# EAGLE design USB_Adapter (EAGLE 6.5.0)
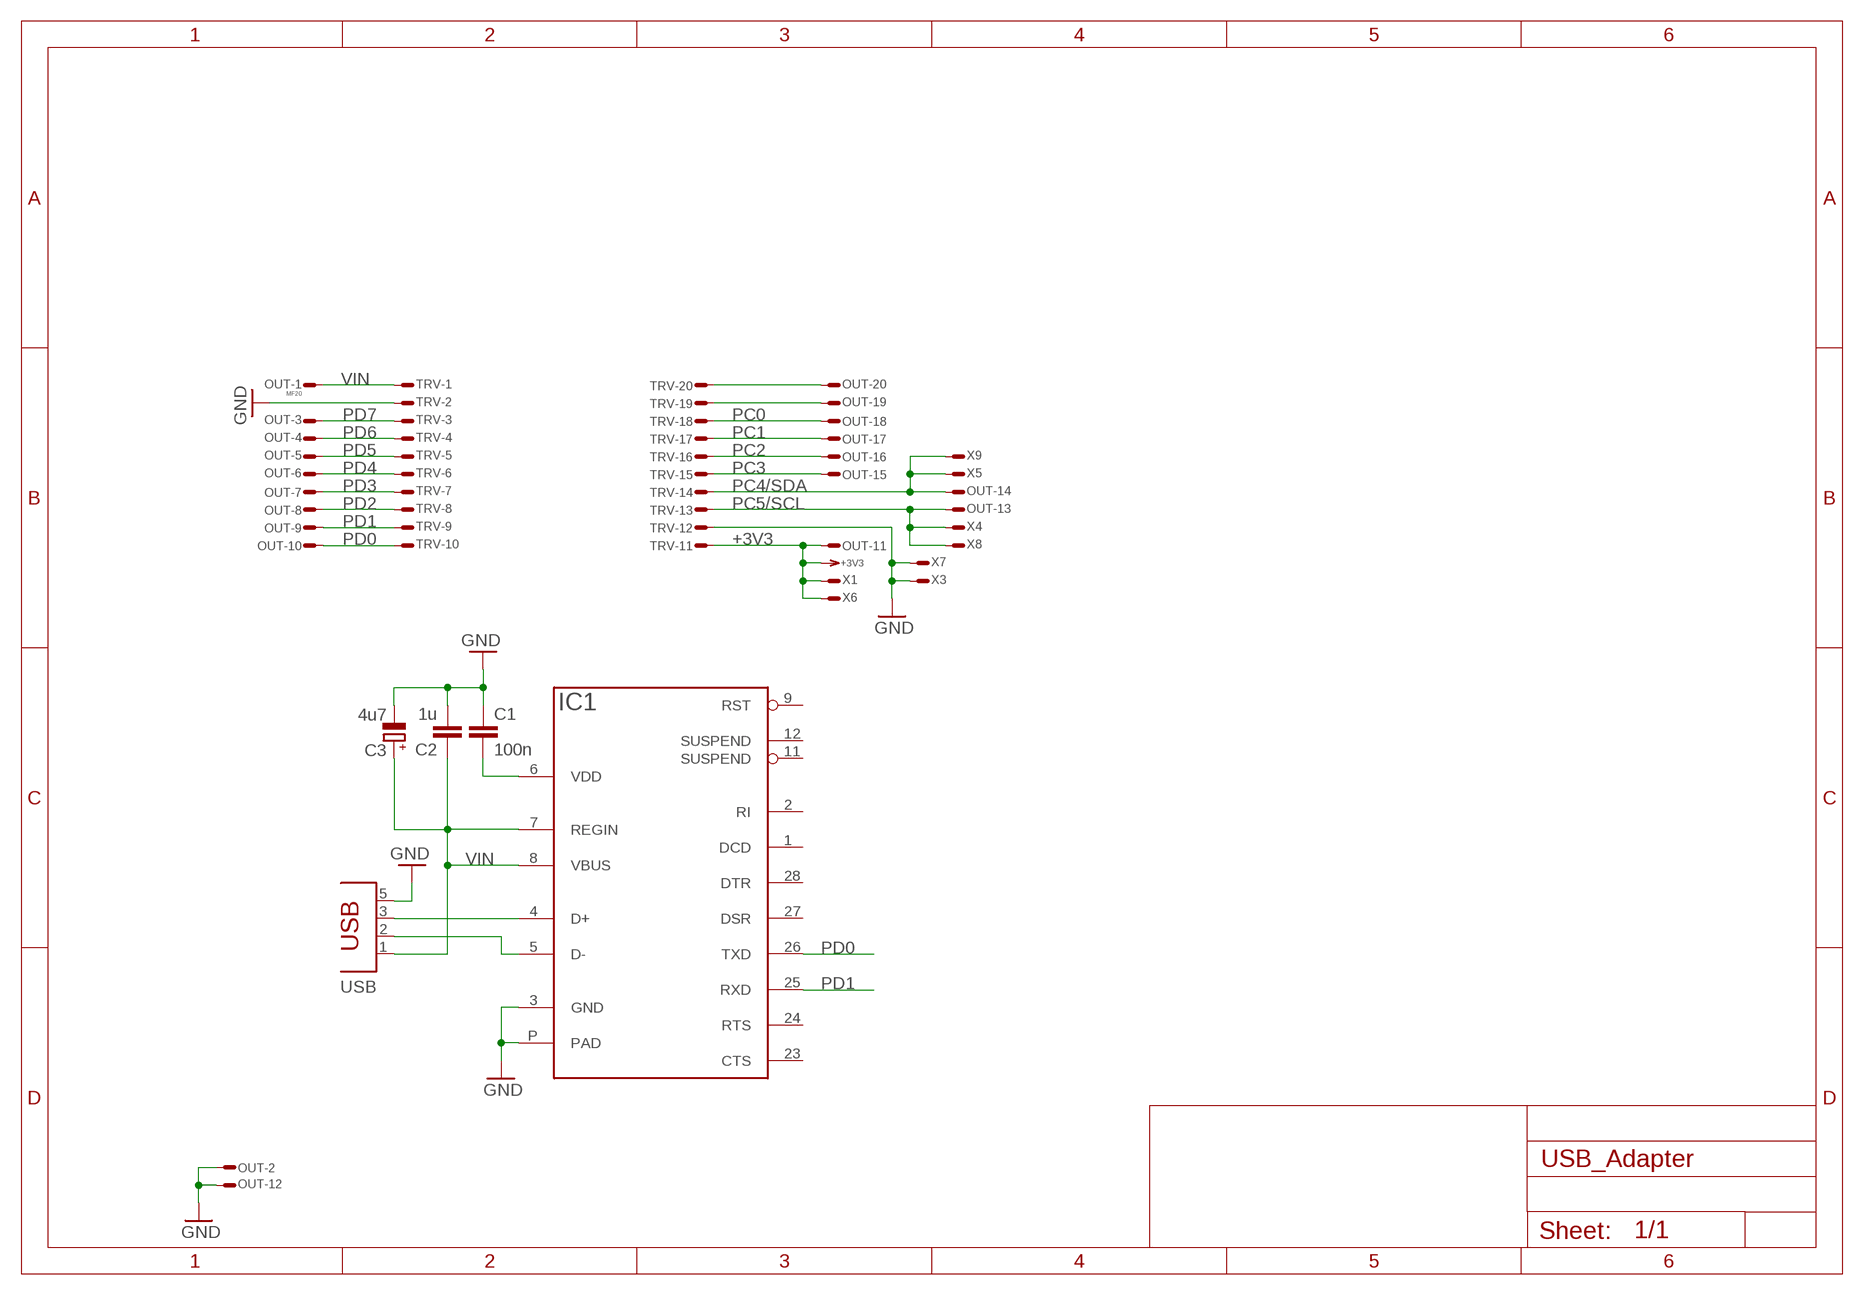
[diagram p0: schematic, sheet 1]

## Parts
C1  100n  C0603  [0603]
C2  1u  C0603  [0603]
C3  4u7  C_POLSMCA  [SMC_A]
IC1  CP2102  [QFN28]
OUT  MF20  ML20SE  [ML20S]
TRV  ML20SE  [ML20S]
USB  USBBM  [USB-BM]
X1  WIREPADT1.6/0.9  [T1.6/0.9]
X3  WIREPADT1.6/0.9  [T1.6/0.9]
X4  WIREPADT1.6/0.9  [T1.6/0.9]
X5  WIREPADT1.6/0.9  [T1.6/0.9]
X6  WIREPADT1.6/0.9  [T1.6/0.9]
X7  WIREPADT1.6/0.9  [T1.6/0.9]
X8  WIREPADT1.6/0.9  [T1.6/0.9]
X9  WIREPADT1.6/0.9  [T1.6/0.9]

## Nets
+3V3: OUT.11 TRV.11 X1.1(S) X6.1(S)
GND: C1.1 C2.2 C3.- IC1.3(GND) IC1.P(PAD) OUT.2 OUT.12 TRV.2 TRV.12 USB.5(GND) X3.1(S) X7.1(S)
N$1: OUT.20 TRV.20
N$2: C1.2 IC1.6(VDD)
N$3: OUT.19 TRV.19
N$4: IC1.4(D+) USB.3(D+)
N$6: IC1.5(D-) USB.2(D-)
PC0: OUT.18 TRV.18
PC1: OUT.17 TRV.17
PC2: OUT.16 TRV.16
PC3: OUT.15 TRV.15
PC4/SDA: OUT.14 TRV.14 X5.1(S) X9.1(S)
PC5/SCL: OUT.13 TRV.13 X4.1(S) X8.1(S)
PD0: IC1.26(TXD) OUT.10 TRV.10
PD1: IC1.25(RXD) OUT.9 TRV.9
PD2: OUT.8 TRV.8
PD3: OUT.7 TRV.7
PD4: OUT.6 TRV.6
PD5: OUT.5 TRV.5
PD6: OUT.4 TRV.4
PD7: OUT.3 TRV.3
VIN: C2.1 C3.+ IC1.7(REGIN) IC1.8(VBUS) OUT.1 TRV.1 USB.1(VCC)
Unconnected: IC1.1(DCD) IC1.2(RI) IC1.9(RST) IC1.11(SUSPEND) IC1.12(SUSPEND) IC1.23(CTS) IC1.24(RTS) IC1.27(DSR) IC1.28(DTR)

## Library data of the parts
C1 C2 = RCL:C: Capacitor SMD
C3 = RCL:C_POL: POLARIZED CAPACITOR, European symbol
IC1 = ICs:CP2102
OUT TRV = Conn:ML20?E: HARTING
USB = Conn:USB: BERG USB connector
X1 X3-X9 = Conn:WIREPAD: Wire PAD connect wire on PCB

## Board
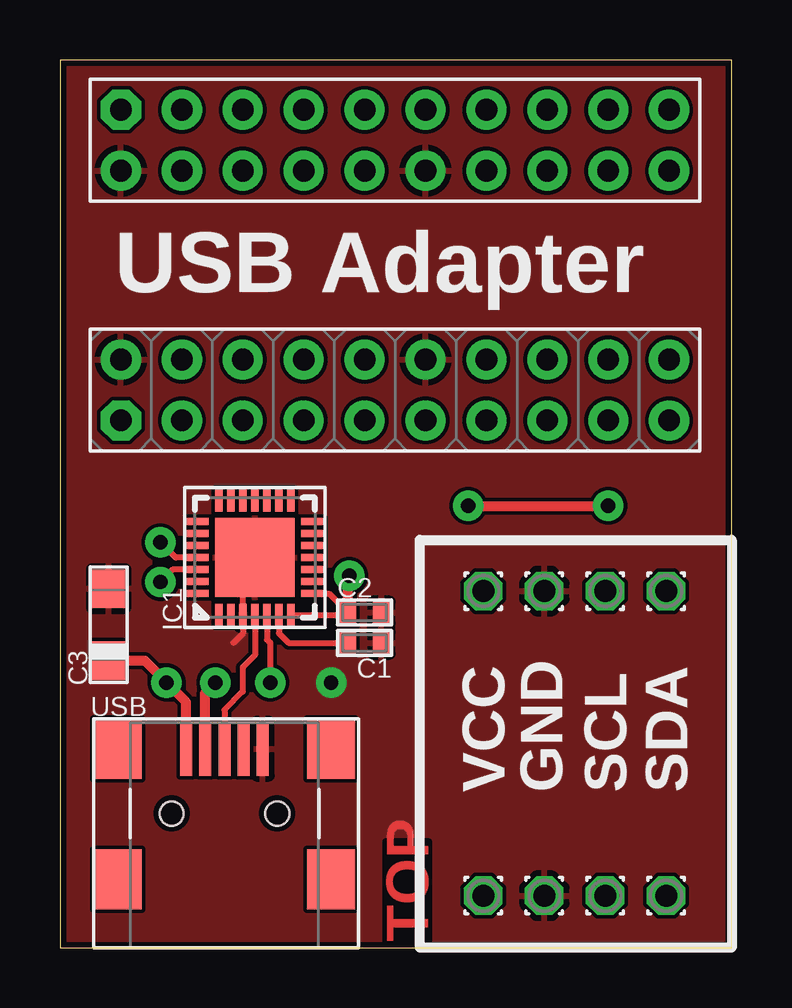
[diagram p1: board, top side]
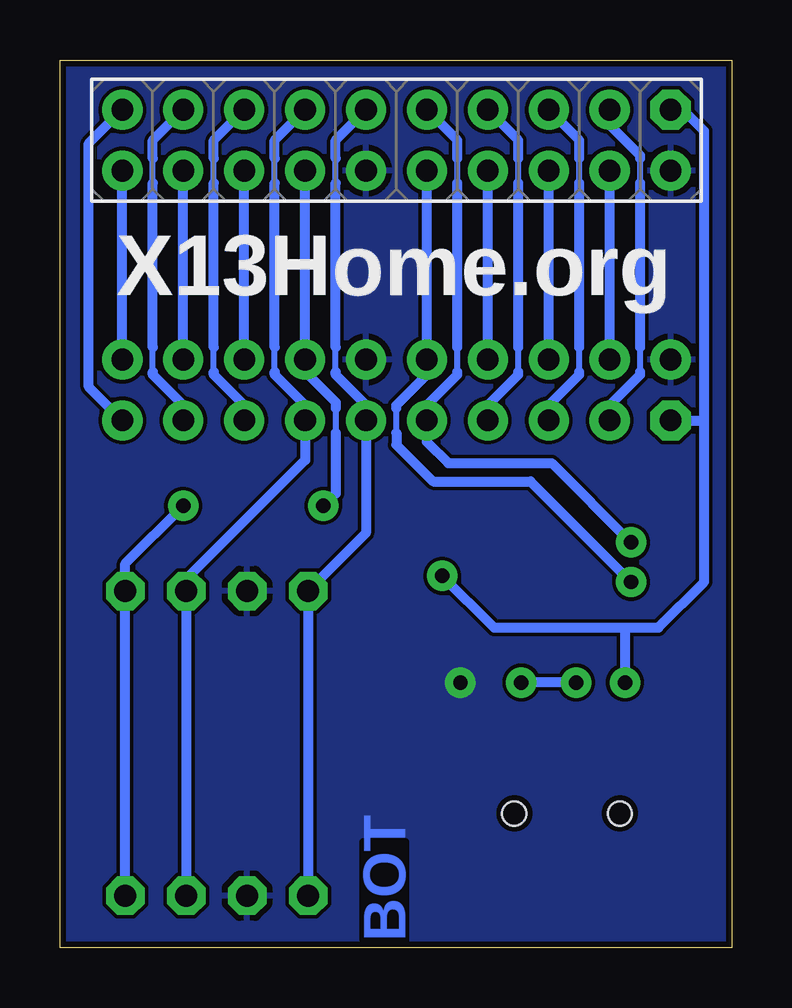
[diagram p2: board, bottom side, seen from below]

Size 28 x 37 mm. Coordinates in mm from the lower left corner, seen from the top.
Outline: 0,0 28,0 28,37 0,37 0,0
Copper layers (1*2*15*16): Top 0.035mm / dielectric 0.2mm / Route2 0.0175mm / dielectric 1.1mm / Route15 0.0175mm / dielectric 0.2mm / Bottom 0.035mm
Design rules "SeeedStudio_DRU_no_angle_20130527": minimum track width 6mil, minimum drill 12mil, track to track 6mil, track to pad 6mil, pad to pad 6mil, via to via 6mil, smd to smd 0mil, copper to edge 10mil, drill to drill 10mil, minimum pad ring 6mil, minimum via ring 6mil, stop-mask expansion 2mil, vias tented up to drill 25mil, thermal gap 10mil

### Footprints (pad centres in the part's own frame; a part is rotated, then mirrored left to right if it is on the bottom)
0603 = smd 0.7 x 0.9: 1 -0.697,0; 2 0.697,0
SMC_A = smd 1.6 x 1.4: + -1.5,0; - 1.5,0
QFN28 = smd 0.95 x 0.3: 1 -2.4,1.5; 2 -2.4,1; 3 -2.4,0.5; 4 -2.4,0; 5 -2.4,-0.5; 6 -2.4,-1; 7 -2.4,-1.5; 15 2.4,-1.5; 16 2.4,-1; 17 2.4,-0.5; 18 2.4,0; 19 2.4,0.5; 20 2.4,1; 21 2.4,1.5 | smd 0.3 x 0.95: 8 -1.5,-2.4; 9 -1,-2.4; 10 -0.5,-2.4; 11 0,-2.4; 12 0.5,-2.4; 13 1,-2.4; 14 1.5,-2.4; 22 1.5,2.4; 23 1,2.4; 24 0.5,2.4; 25 0,2.4; 26 -0.5,2.4; 27 -1,2.4; 28 -1.5,2.4 | smd 3.3 x 3.3: P 0,0
ML20S = drill 0.9 pad 1.676 octagon: 1 -11.43,-1.27 | drill 0.9 pad 1.676: 2 -11.43,1.27; 3 -8.89,-1.27; 4 -8.89,1.27; 5 -6.35,-1.27; 6 -6.35,1.27; 7 -3.81,-1.27; 8 -3.81,1.27; 9 -1.27,-1.27; 10 -1.27,1.27; 11 1.27,-1.27; 12 1.27,1.27; 13 3.81,-1.27; 14 3.81,1.27; 15 6.35,-1.27; 16 6.35,1.27; 17 8.89,-1.27; 18 8.89,1.27; 19 11.43,-1.27; 20 11.43,1.27
USB-BM = smd 0.5 x 2.25: 1 -1.6,2.7; 2 -0.8,2.7; 3 0,2.7; 4 0.8,2.7; 5 1.6,2.7 | smd 2 x 2.5: E1 -4.45,-2.75; E2 4.45,-2.75; E3 -4.45,2.7; E4 4.45,2.7 | hole 1: -2.2,0; 2.2,0
T1.6/0.9 = drill 0.914 pad 1.6 octagon: 1 0,0

### Placement (x,y rotation side)
C1  12.7,12.7 180 top
C2  12.7,13.97 0 top
C3  2.03,13.46 90 top
IC1  8.13,16.26 90 top
OUT  13.97,23.24 0 top
TRV  13.97,33.66 180 bottom
USB  6.86,5.59 0 top
X1  17.65,2.16 90 top
X3  20.19,2.16 90 top
X4  22.73,2.16 90 top
X5  25.27,2.16 90 top
X6  17.65,14.86 270 top
X7  20.19,14.86 270 top
X8  22.73,14.86 270 top
X9  25.27,14.86 270 top

### Tracks (layer width: path | path; a pad name or v marks a point on that pad's centre or on a via)
+3V3
  Bottom 0.254: 16.51,24 16.51,25.02 | 16.51,31.88 16.51,32.89
  Bottom 0.406: 16.51,24 16.51,23.88 15.24,22.61 OUT.11 15.24,17.27 X6.1 X1.1 | TRV.11 16.51,33.66 16.51,32.89 | 16.51,25.02 16.51,31.88
GND  (via drill 0.6 pad 1.27)
  Top 0.254: IC1.P 7.63,15.76 IC1.3 7.63,13.09 7.24,12.7
  other vias: 11.3,11.05
  pour Bottom: 0,0 28,0 28,37 0,37
  pour Top: 0,0 28,0 28,37 0,37
N$1
  Bottom 0.406: OUT.20 TRV.20
N$2
  Top 0.254: IC1.6 9.13,13.1 9.53,12.7 C1.2
N$3
  Bottom 0.406: OUT.19 26.8,23.37 26.8,33.53 TRV.19
N$4
  Top 0.254: IC1.4 8.13,12.19 7.62,11.68 7.62,10.67 6.86,9.91 USB.3
N$6  (via drill 0.6 pad 1.27)
  Top 0.254: IC1.5 8.63,12.84 8.76,12.7 v8.76,11.05
  Top 0.406: USB.2 6.06,10.63 v6.48,11.05
  Bottom 0.406: v6.48,11.05 v8.76,11.05
PC0
  Bottom 0.406: OUT.18 TRV.18
PC1
  Bottom 0.254: 24.13,24 24.13,25.02 | 24.13,31.88 24.13,32.89
  Bottom 0.406: OUT.17 22.86,22.61 24.13,23.88 24.13,24 | TRV.17 24.13,33.66 24.13,32.89 | 24.13,25.02 24.13,31.88
PC2
  Bottom 0.406: OUT.16 TRV.16
PC3
  Bottom 0.254: 21.59,24 21.59,25.02 | 21.59,31.88 21.59,32.89
  Bottom 0.406: OUT.15 20.32,22.61 21.59,23.88 21.59,24 | TRV.15 21.59,33.66 21.59,32.89 | 21.59,25.02 21.59,31.88
PC4/SDA  (via drill 0.6 pad 1.27)
  Top 0.406: v17.02,18.41 v22.86,18.41
  Bottom 0.254: 16.51,22.48 16.51,21.46
  Bottom 0.406: TRV.14 OUT.14 17.78,24 16.51,22.73 16.51,22.48 | 16.51,21.46 16.51,18.92 v17.02,18.41 | X5.1 X9.1 25.27,16 v22.86,18.41
PC5/SCL
  Bottom 0.254: 19.05,24 19.05,25.02 | 19.05,31.88 19.05,32.89
  Bottom 0.406: 19.05,24 19.05,23.88 17.78,22.61 OUT.13 17.78,20.32 22.73,15.37 X8.1 X4.1 | TRV.13 19.05,33.66 19.05,32.89 | 19.05,25.02 19.05,31.88
PD0  (via drill 0.6 pad 1.27)
  Top 0.254: IC1.26 4.71,15.76 v4.19,15.24
  Bottom 0.254: 13.97,21.46 13.97,22.48
  Bottom 0.406: TRV.10 OUT.10 12.7,23.88 13.97,22.61 13.97,22.48 | 13.97,21.46 13.97,20.95 12.45,19.43 8.38,19.43 v4.19,15.24
PD1  (via drill 0.6 pad 1.27)
  Top 0.254: IC1.25 4.83,16.26 v4.19,16.89
  Bottom 0.254: 11.43,24 11.43,25.02 | 11.43,31.88 11.43,32.89
  Bottom 0.406: 11.43,24 11.43,23.88 12.7,22.61 OUT.9 12.7,21.08 11.81,20.19 7.49,20.19 v4.19,16.89 | TRV.9 11.43,33.66 11.43,32.89 | 11.43,25.02 11.43,31.88
PD2
  Bottom 0.406: OUT.8 TRV.8
PD3
  Bottom 0.254: 8.89,24 8.89,25.02 | 8.89,31.88 8.89,32.89
  Bottom 0.406: OUT.7 10.16,22.61 8.89,23.88 8.89,24 | TRV.7 8.89,33.66 8.89,32.89 | 8.89,25.02 8.89,31.88
PD4
  Bottom 0.406: OUT.6 TRV.6
PD5
  Bottom 0.254: 6.35,24 6.35,25.02 | 6.35,31.88 6.35,32.89
  Bottom 0.406: OUT.5 7.62,22.61 6.35,23.88 6.35,24 | TRV.5 6.35,33.66 6.35,32.89 | 6.35,25.02 6.35,31.88
PD6
  Bottom 0.406: OUT.4 TRV.4
PD7
  Bottom 0.254: 3.81,24 3.81,25.02 | 3.81,31.88 3.81,32.89
  Bottom 0.406: OUT.3 5.08,22.61 3.81,23.88 3.81,24 | TRV.3 5.08,34.29 3.81,33.02 3.81,32.89 | 3.81,25.02 3.81,31.88
VIN  (via drill 0.6 pad 1.27)
  Top 0.254: IC1.7 11.89,13.86 C2.1 11.22,14.76 IC1.8
  Top 0.406: 12.06,13.91 C2.1 12,15.43 v12.06,15.49 | USB.1 5.26,10.24 v4.45,11.05 3.53,11.96 C3.+
  Bottom 0.406: TRV.1 2.03,34.92 1.14,34.04 1.14,21.97 | OUT.1 1.14,21.97 | v12.06,15.49 9.91,13.34 4.45,13.34 | 4.45,13.34 v4.45,11.05 | 4.45,13.34 3.05,13.34 1.14,15.24 1.14,21.97

### Text on the board
Top: TOP
Bottom: BOT
tNames: USB Adapter | VCC | GND | SCL | SDA
bNames: X13Home.org